# Altium schematic sheet 2_MCU.schdoc.schdoc
size 309 x 223 mm; Symbol: Sheet-Symbol_A4; Device: Sheet-Symbol_A4; Company: 嘉立创EDA; Drawed: 吴登珂; Version: V1.0; Page Size: A4; @Project Name: 最小系统板; @Page Count: 4; @Update Date: 2024-04-09; @Create Date: 2024-04-05; @Schematic Name: Schematic1; @Page No: 3; @Page Name: MCU; SheetNumber: 2; SheetTotal: 4
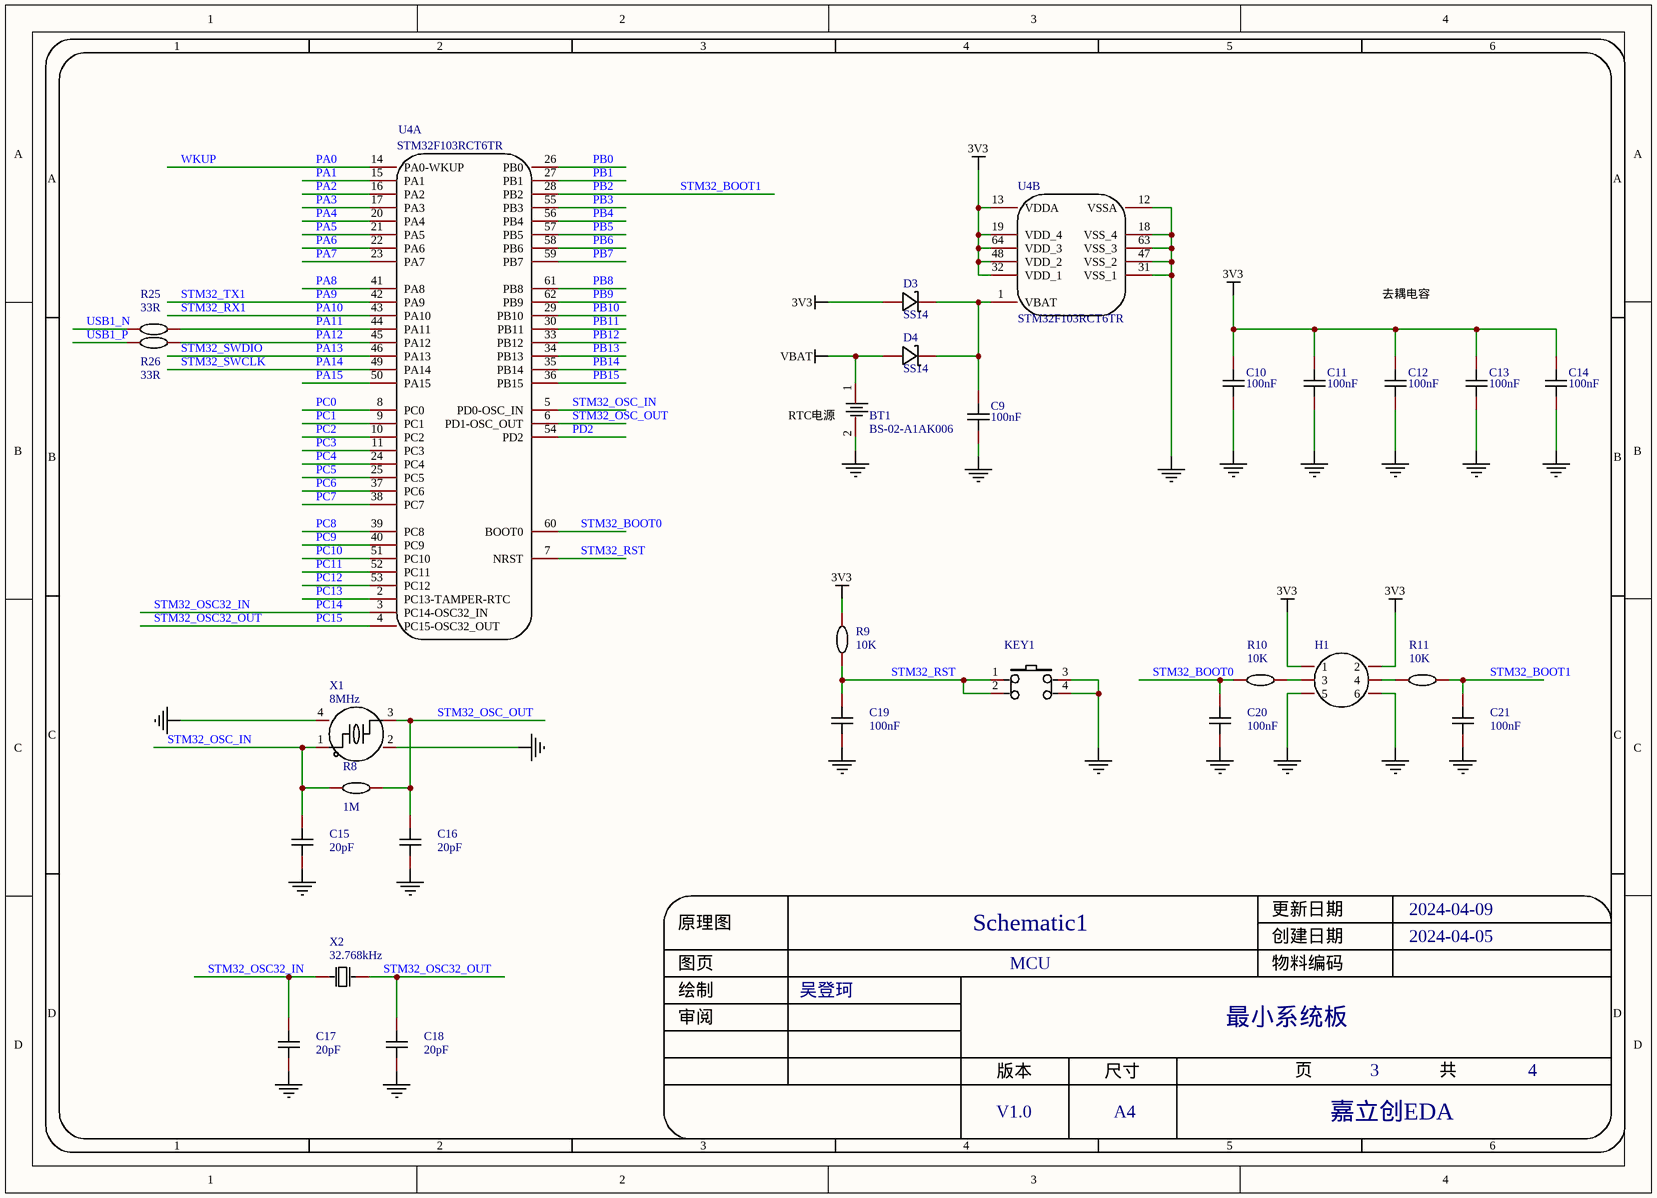
[diagram p0: 2_MCU.schdoc.schdoc]

## Parts
BT1  BS-02-A1AK006  [BAT-TH_BS-02-A1AK006]
C9  100nF  [C0603]
C10  100nF  [C0603]
C11  100nF  [C0603]
C12  100nF  [C0603]
C13  100nF  [C0603]
C14  100nF  [C0603]
C15  20pF  [C0603]
C16  20pF  [C0603]
C17  20pF  [C0603]
C18  20pF  [C0603]
C19  100nF  [C0603]
C20  100nF  [C0603]
C21  100nF  [C0603]
D3  SS14  [SMA_L4.3-W2.6-LS5.2-RD]
D4  SS14  [SMA_L4.3-W2.6-LS5.2-RD]
H1  HDR-F_2.54_2x3  [HDR-TH_6P-P2.54-V-F-R2-C3-S2.54]  (value not drawn)
KEY1  6x6x6塑料头  [SW-SMD_4P-L6.0-W6.0-P4.50-LS8.6]  (value not drawn)
R8  1M  [R0603]
R9  10K  [R0603]
R10  10K  [R0603]
R11  10K  [R0603]
R25  33R  [R0603]
R26  33R  [R0603]
U4  STM32F103RCT6TR  [LQFP-64_L10.0-W10.0-P0.50-LS12.0-BL]  (parts A,B of 2)
X1  8MHz  [OSC-SMD_4P-L3.2-W2.5-BL]
X2  32.768kHz  [OSC-SMD_L3.2-W1.5]

## Nets
3V3: C10.2 C11.2 C12.2 C13.2 C14.2 D3.2(A) H1.1 H1.2 R9.2 U4.13(VDDA) U4.19(VDD_4) U4.32(VDD_1) U4.48(VDD_2) U4.64(VDD_3)
NetBT1_2: BT1.2 C9.1 C10.1 C11.1 C12.1 C13.1 C14.1 C15.1 C16.1 C17.1 C18.1 C19.1 C20.1 C21.1 H1.5 H1.6 KEY1.3 KEY1.4 U4.12(VSSA) U4.18(VSS_4) U4.31(VSS_1) U4.47(VSS_2) U4.63(VSS_3) X1.2(GND) X1.4(GND)
VBAT: BT1.1 D4.2(A)
PA0: U4.14(PA0-WKUP)  [also labelled WKUP]
PA1: U4.15(PA1)
PA2: U4.16(PA2)
PA3: U4.17(PA3)
PA4: U4.20(PA4)
PA5: U4.21(PA5)
PA6: U4.22(PA6)
PA7: U4.23(PA7)
PA8: U4.41(PA8)
PA9: U4.42(PA9)  [also labelled STM32_TX1]
PA10: U4.43(PA10)  [also labelled STM32_RX1]
PA11: R25.2 U4.44(PA11)
PA12: R26.2 U4.45(PA12)
PA13: U4.46(PA13)  [also labelled STM32_SWDIO]
PA14: U4.49(PA14)  [also labelled STM32_SWCLK]
PA15: U4.50(PA15)
PB0: U4.26(PB0)
PB1: U4.27(PB1)
PB2: C21.2 R11.2 U4.28(PB2)  [also labelled STM32_BOOT1]
PB3: U4.55(PB3)
PB4: U4.56(PB4)
PB5: U4.57(PB5)
PB6: U4.58(PB6)
PB7: U4.59(PB7)
PB8: U4.61(PB8)
PB9: U4.62(PB9)
PB10: U4.29(PB10)
PB11: U4.30(PB11)
PB12: U4.33(PB12)
PB13: U4.34(PB13)
PB14: U4.35(PB14)
PB15: U4.36(PB15)
PC0: U4.8(PC0)
PC1: U4.9(PC1)
PC2: U4.10(PC2)
PC3: U4.11(PC3)
PC4: U4.24(PC4)
PC5: U4.25(PC5)
PC6: U4.37(PC6)
PC7: U4.38(PC7)
PC8: U4.39(PC8)
PC9: U4.40(PC9)
PC10: U4.51(PC10)
PC11: U4.52(PC11)
PC12: U4.53(PC12)
PC13: U4.2(PC13-TAMPER-RTC)
PC14: C17.2 U4.3(PC14-OSC32_IN) X2.1(OSC1)  [also labelled STM32_OSC32_IN]
PC15: C18.2 U4.4(PC15-OSC32_OUT) X2.2(OSC2)  [also labelled STM32_OSC32_OUT]
PD2: U4.54(PD2)
STM32_BOOT0: C20.2 R10.1 U4.60(BOOT0)
STM32_OSC_IN: C15.2 R8.1 U4.5(PD0-OSC_IN) X1.1
STM32_OSC_OUT: C16.2 R8.2 U4.6(PD1-OSC_OUT) X1.3
STM32_RST: C19.2 KEY1.1 KEY1.2 R9.1 U4.7(NRST)
USB1_N: R25.1
USB1_P: R26.1
NetC9_2: C9.2 D3.1(K) D4.1(K) U4.1(VBAT)
NetH1_3: H1.3 R10.2
NetH1_4: H1.4 R11.1

## Notes on the sheet
- 去耦电容
- (near BT1) RTC电源
- 1
- 2
- 3
- 4
- 5
- 6
- A
- B
- C
- 原理图
- Schematic1
- 创建日期
- 更新日期
- 2024-04-09
- 2024-04-05
- D
- 审阅
- 绘制
- 图页
- 吴登珂
- MCU
- 物料编码
- 最小系统板
- 版本
- 尺寸
- 页
- 共
- V1.0
- A4
- 嘉立创EDA

## Library data of the parts
BT1 = BS-02-A1AK006: Manufacturer: MYOUNG(美阳); Add into BOM: yes; Connector Type: 电池底座; Battery Type: CR2032; Name: BS-02-A1AK006; Symbol: BS-02-A1AK006; Device: BS-02-A1AK006; LCSC Part Name: 电池底座 适用电池:CR2032; Supplier Part: C964746; Manufacturer Part: BS-02-A1AK006; Supplier Footprint: 插件; JLCPCB Part Class: 扩展库; Datasheet: https://atta.szlcsc.com/upload/public/pdf/source/20201218/C964746_D636BD2F273EEE7B636B6EF7E90F8FC5.pdf; Supplier: LCSC; Convert to PCB: yes; Contact Plating: 锡; Operating Temperature Range: -25℃~+85℃
C9-C21 = CAP_0603: Symbol: CapAcitance; Convert to PCB: yes; Device: CAP_0603; Add into BOM: yes; Supplier Footprint: 0603
  C9-C14 C19-C21: Name: 100nF; Value: 100nF
  C15-C18: Name: 20pF; Value: 20pF
D3 D4 = SS14_C83852: Manufacturer: onsemi(安森美); Add into BOM: yes; Forward Voltage (Vf@If): 500mV@1A; Reverse Voltage (Vr): 40V; Average Rectified Current (Io): 1A; Reverse Leakage Current (Ir): 200uA@40V; Name: SS14; Symbol: SS14_C83852; Device: SS14_C83852; Supplier: LCSC; Supplier Part: C83852; Manufacturer Part: SS14; JLCPCB Part Class: 扩展库; LCSC Part Name: 电压:40V 电流:1A; Supplier Footprint: SMA(DO-214AC); Datasheet: https://atta.szlcsc.com/upload/public/pdf/source/20181222/C83852_041FE29A925F1DAA7D9CB1F1C69076C2.pdf; Convert to PCB: yes
H1 = HDR-F_2.54_2x3: Symbol: HDR-F-2.54_2x3; Convert to PCB: yes; Device: HDR-F_2.54_2x3; Add into BOM: yes; Supplier Part: C92272; Supplier Footprint: 插件
KEY1 = 6x6x6塑料头: Manufacturer: 国产; Symbol: 6x6x6Plastic head; Add into BOM: yes; Switch Length: 6mm; Name: 6x6x6塑料头; Device: 6x6x6塑料头; Supplier Part: C23550; Supplier: LCSC; Manufacturer Part: 6x6x6塑料头; JLCPCB Part Class: 扩展库; LCSC Part Name: 6x6x6 塑料头; Supplier Footprint: SMD; Datasheet: https://atta.szlcsc.com/upload/public/pdf/source/20150923/1457707411939.pdf; Convert to PCB: yes; Switch Width: 6mm; Switch Height: 6mm; Mechanical Life: -
R8-R11 R25 R26 = Res_0603: Symbol: 电阻; Convert to PCB: yes; Device: Res_0603; Add into BOM: yes; Supplier Footprint: 0603
  R8: Name: 1M; Value: 1M
  R9-R11: Name: 10K; Value: 10K
  R25 R26: Name: 33R; Value: 33R
U4 = STM32F103RCT6TR: Manufacturer: ST(意法半导体); Add into BOM: yes; CPU Core: CM3; Program Storage Size: 256KB; RAM Size: 48KB; GPIO Ports Number: 51; Operating Voltage Range: 2V~3.6V; CPU Maximum Speed: 72MHz; Program Memory Type: FLASH; ADC (Bit): 12bit; Universal Serial Bus: 有; Peripheral/Function: 看门狗；DMA；看门狗；片载温度传感器; Name: STM32F103RCT6TR; Symbol: STM32F103RCT6TR; Device: STM32F103RCT6TR; LCSC Part Name: STM32F103RCT6TR; Supplier Part: C39704; Manufacturer Part: STM32F103RCT6TR; Supplier Footprint: LQFP-64(10x10); JLCPCB Part Class: 扩展库; Datasheet: https://atta.szlcsc.com/upload/public/pdf/source/20151012/1457707442737.pdf; Supplier: LCSC; Convert to PCB: yes; Operating Temperature Range: -40℃~+85℃; DAC (Bit): 12bit; PWM (Bit): -; Internal Comparator: -; communication protocol: -; Watchdog: 有; Real-Time Clock: -; Infrared Data Association: 有; Low-Voltage Detect: 有; CCP Capture/Compare: -; Secure Digital Input and Output: -; Direct Memory Access: 有; Internal Oscillator: 有
X1 = X32258MOB4SI: Manufacturer: YXC(扬兴晶振); Add into BOM: yes; Crystal Type: 贴片晶振; Normal temperature Frequency Tolerance: ±10ppm; External load capacitor: 12pF; Frequency Stability(Full temperature range): ±20ppm; Equivalent Series Resistance (ESR): 150Ω; Name: 8MHz; Symbol: X32258MOB4SI; Device: X32258MOB4SI; LCSC Part Name: 8MHz ±10ppm 12pF; Supplier Part: C2682775; Manufacturer Part: X32258MOB4SI; Supplier Footprint: SMD3225-4P; JLCPCB Part Class: 扩展库; Datasheet: https://atta.szlcsc.com/upload/public/pdf/source/20240329/19D5F850207469550BEB00D7DFEDBC7A.pdf; Supplier: LCSC; Convert to PCB: yes; Value: 8MHz; Operating Temperature: -40℃~+85℃
X2 = DST310S 32.768KHz: Manufacturer: KDS(大真空); Add into BOM: yes; Name: 32.768kHz; Symbol: DST310S 32.768KHz; Device: DST310S 32.768KHz; LCSC Part Name: 32.768KHz 12.5PF 20ppm; Supplier Part: C93232; Manufacturer Part: DST310S 32.768KHz; Supplier Footprint: SMD3215-2P; JLCPCB Part Class: 扩展库; Datasheet: https://atta.szlcsc.com/upload/public/pdf/source/20170919/C93232_1505799689477977622.pdf; Supplier: LCSC; Convert to PCB: yes; Crystal Type: -; Value: 32.768kHz; External load capacitor: -; Operating Temperature: -